# EAGLE design 28wide (EAGLE 6.6.0)
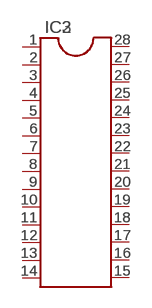
[diagram p0: schematic, sheet 1]

## Parts
IC2  DIL28  [DIL28-6]
IC3  DIL28-3  [DIL28-3]

## Nets
N$1: IC2.1 IC3.1
N$2: IC2.2 IC3.2
N$3: IC2.3 IC3.3
N$4: IC2.4 IC3.4
N$5: IC2.5 IC3.5
N$6: IC2.6 IC3.6
N$7: IC2.7 IC3.7
N$8: IC2.8 IC3.8
N$9: IC2.9 IC3.9
N$10: IC2.10 IC3.10
N$11: IC2.11 IC3.11
N$12: IC2.12 IC3.12
N$13: IC2.13 IC3.13
N$14: IC2.14 IC3.14
N$15: IC2.15 IC3.15
N$16: IC2.16 IC3.16
N$17: IC2.17 IC3.17
N$18: IC2.18 IC3.18
N$19: IC2.19 IC3.19
N$20: IC2.20 IC3.20
N$21: IC2.21 IC3.21
N$22: IC2.22 IC3.22
N$23: IC2.23 IC3.23
N$24: IC2.24 IC3.24
N$25: IC2.25 IC3.25
N$26: IC2.26 IC3.26
N$27: IC2.27 IC3.27
N$28: IC2.28 IC3.28

## Library data of the parts
IC2 IC3 = ic-package:DIL28: Dual In Line

## Board
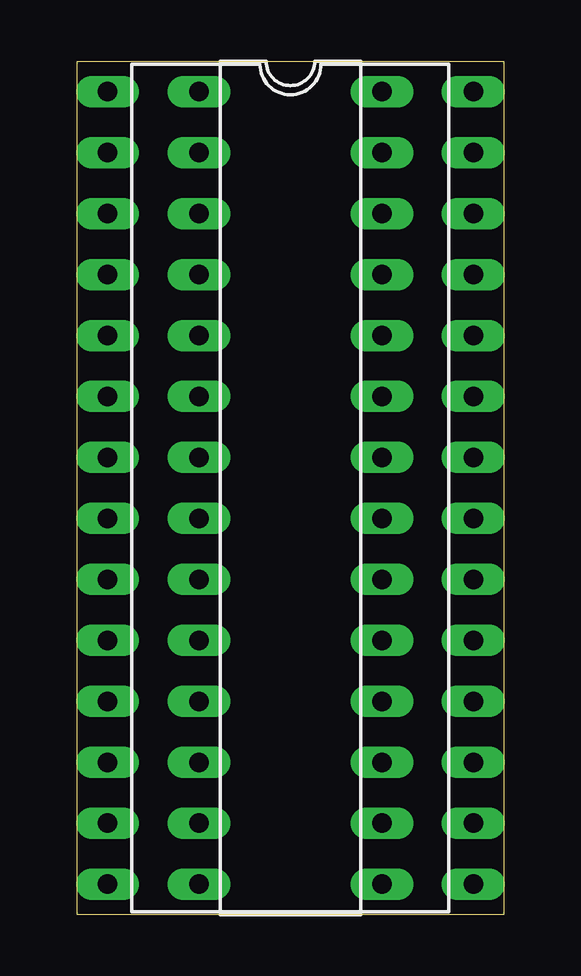
[diagram p1: board, top side]
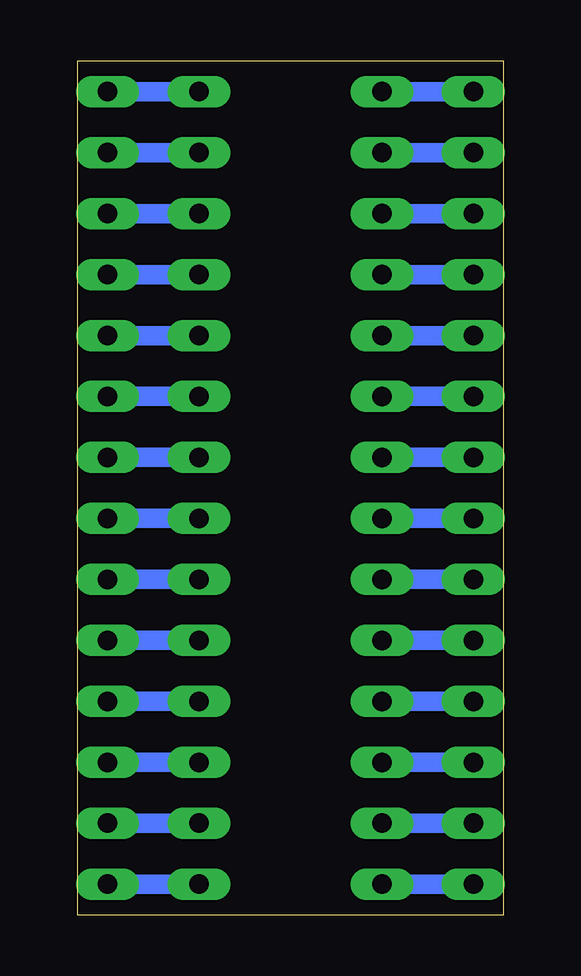
[diagram p2: board, bottom side, seen from below]

Size 17.78 x 35.56 mm. Coordinates in mm from the lower left corner, seen from the top.
Outline: 0,0 0,35.56 17.78,35.56 17.78,0 0,0
Copper layers (1+16): Top 0.035mm / dielectric 1.5mm / Bottom 0.035mm
Design rules "16mils": minimum track width 16mil, minimum drill 32mil, track to track 15mil, track to pad 10mil, pad to pad 10mil, via to via 10mil, smd to smd 10mil, copper to edge 13mil, drill to drill 10mil, minimum pad ring 10mil, minimum via ring 8mil, stop-mask expansion 0mil, vias tented up to drill 0mil, thermal gap 10mil

### Footprints (pad centres in the part's own frame; a part is rotated, then mirrored left to right if it is on the bottom)
DIL28-6 = drill 0.813 long: 1 -16.51,-7.62; 2 -13.97,-7.62; 3 -11.43,-7.62; 4 -8.89,-7.62; 5 -6.35,-7.62; 6 -3.81,-7.62; 7 -1.27,-7.62; 8 1.27,-7.62; 9 3.81,-7.62; 10 6.35,-7.62; 11 8.89,-7.62; 12 11.43,-7.62; 13 13.97,-7.62; 14 16.51,-7.62; 15 16.51,7.62; 16 13.97,7.62; 17 11.43,7.62; 18 8.89,7.62; 19 6.35,7.62; 20 3.81,7.62; 21 1.27,7.62; 22 -1.27,7.62; 23 -3.81,7.62; 24 -6.35,7.62; 25 -8.89,7.62; 26 -11.43,7.62; 27 -13.97,7.62; 28 -16.51,7.62
DIL28-3 = drill 0.813 long: 1 -16.51,-3.81; 2 -13.97,-3.81; 3 -11.43,-3.81; 4 -8.89,-3.81; 5 -6.35,-3.81; 6 -3.81,-3.81; 7 -1.27,-3.81; 8 1.27,-3.81; 9 3.81,-3.81; 10 6.35,-3.81; 11 8.89,-3.81; 12 11.43,-3.81; 13 13.97,-3.81; 14 16.51,-3.81; 15 16.51,3.81; 16 13.97,3.81; 17 11.43,3.81; 18 8.89,3.81; 19 6.35,3.81; 20 3.81,3.81; 21 1.27,3.81; 22 -1.27,3.81; 23 -3.81,3.81; 24 -6.35,3.81; 25 -8.89,3.81; 26 -11.43,3.81; 27 -13.97,3.81; 28 -16.51,3.81

### Placement (x,y rotation side)
IC2  8.89,17.78 270 top
IC3  8.89,17.78 270 top

### Tracks (layer width: path | path; a pad name or v marks a point on that pad's centre or on a via)
N$1
  Bottom 0.813: IC3.1 IC2.1
N$2
  Bottom 0.813: IC3.2 IC2.2
N$3
  Bottom 0.813: IC3.3 IC2.3
N$4
  Bottom 0.813: IC3.4 IC2.4
N$5
  Bottom 0.813: IC3.5 IC2.5
N$6
  Bottom 0.813: IC3.6 IC2.6
N$7
  Bottom 0.813: IC3.7 IC2.7
N$8
  Bottom 0.813: IC3.8 IC2.8
N$9
  Bottom 0.813: IC3.9 IC2.9
N$10
  Bottom 0.813: IC3.10 IC2.10
N$11
  Bottom 0.813: IC3.11 IC2.11
N$12
  Bottom 0.813: IC3.12 IC2.12
N$13
  Bottom 0.813: IC3.13 IC2.13
N$14
  Bottom 0.813: IC3.14 IC2.14
N$15
  Bottom 0.813: IC2.15 IC3.15
N$16
  Bottom 0.813: IC2.16 IC3.16
N$17
  Bottom 0.813: IC2.17 IC3.17
N$18
  Bottom 0.813: IC2.18 IC3.18
N$19
  Bottom 0.813: IC2.19 IC3.19
N$20
  Bottom 0.813: IC2.20 IC3.20
N$21
  Bottom 0.813: IC2.21 IC3.21
N$22
  Bottom 0.813: IC2.22 IC3.22
N$23
  Bottom 0.813: IC2.23 IC3.23
N$24
  Bottom 0.813: IC2.24 IC3.24
N$25
  Bottom 0.813: IC2.25 IC3.25
N$26
  Bottom 0.813: IC2.26 IC3.26
N$27
  Bottom 0.813: IC2.27 IC3.27
N$28
  Bottom 0.813: IC2.28 IC3.28